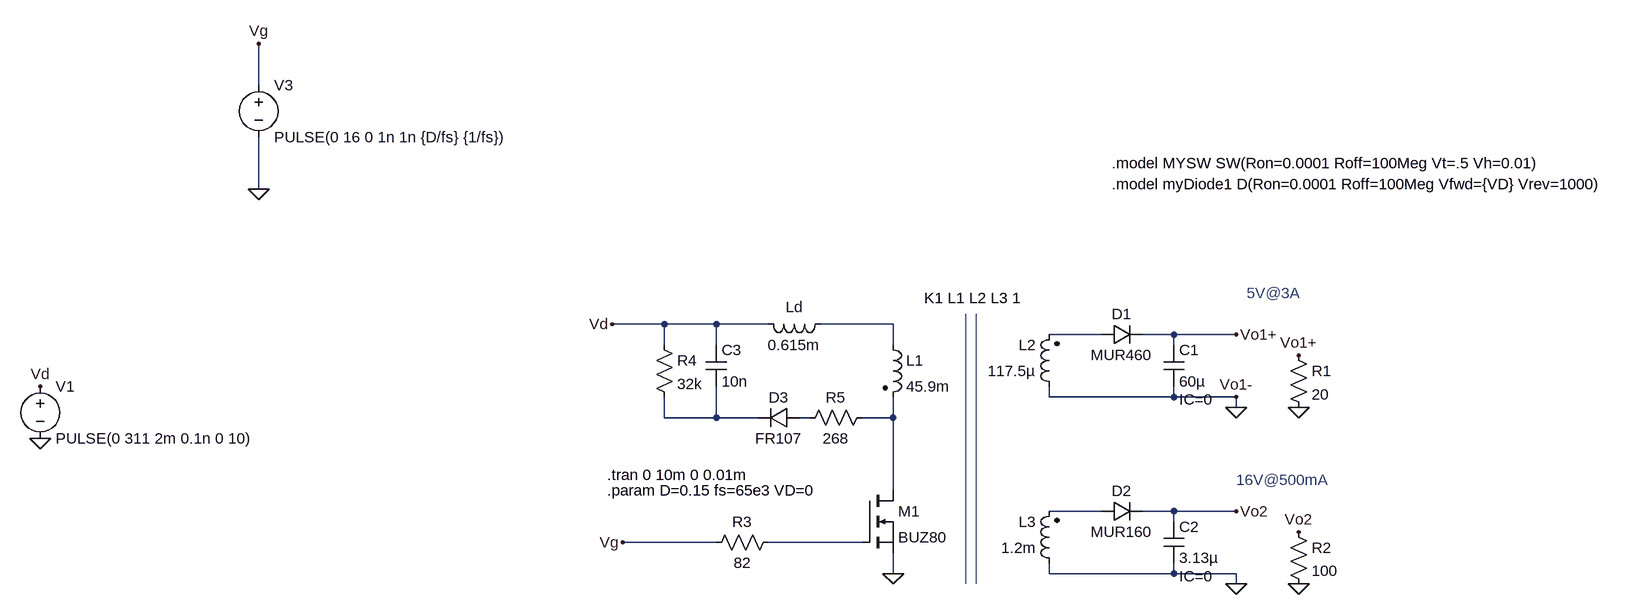
[diagram p0: schematic flyback_sin_realimentar.asc]
flyback_sin_realimentar.asc, the LTspice schematic file:
Version 4.1
SHEET 1 2496 3908
WIRE -592 -288 -592 -352
WIRE -592 -128 -592 -208
WIRE 32 80 -48 80
WIRE 112 80 32 80
WIRE 192 80 112 80
WIRE 384 80 272 80
WIRE 704 96 624 96
WIRE 816 96 768 96
WIRE 912 96 816 96
WIRE 32 112 32 80
WIRE 112 112 112 80
WIRE 384 112 384 80
WIRE 816 112 816 96
WIRE 624 192 624 176
WIRE 816 192 816 176
WIRE 816 192 624 192
WIRE 912 192 816 192
WIRE 912 208 912 192
WIRE 32 224 32 192
WIRE 112 224 112 176
WIRE 112 224 32 224
WIRE 176 224 112 224
WIRE 256 224 240 224
WIRE 384 224 384 192
WIRE 384 224 336 224
WIRE 384 336 384 224
WIRE 704 368 624 368
WIRE 816 368 768 368
WIRE 912 368 816 368
WIRE 816 384 816 368
WIRE 112 416 -32 416
WIRE 336 416 192 416
WIRE 384 464 384 432
WIRE 624 464 624 448
WIRE 816 464 816 448
WIRE 816 464 624 464
WIRE 912 464 816 464
WIRE 912 480 912 464
FLAG -928 256 0
FLAG -928 176 Vd
FLAG -48 80 Vd
FLAG 912 96 Vo1+
FLAG 912 368 Vo2
FLAG 912 480 0
FLAG 912 192 Vo1-
FLAG 912 208 0
FLAG 1008 128 Vo1+
FLAG 1008 208 0
FLAG 1008 400 Vo2
FLAG 1008 480 0
FLAG 384 464 0
FLAG -592 -128 0
FLAG -592 -352 Vg
FLAG -32 416 Vg
SYMBOL ind2 640 192 R180
WINDOW 0 36 80 Left 2
WINDOW 3 36 40 Left 2
SYMATTR InstName L2
SYMATTR Value 117.5µ
SYMATTR Type ind
SYMBOL ind2 368 96 R0
SYMATTR InstName L1
SYMATTR Value 45.9m
SYMATTR Type ind
SYMBOL voltage -928 160 R0
WINDOW 123 0 0 Left 0
WINDOW 39 0 0 Left 0
SYMATTR InstName V1
SYMATTR Value PULSE(0 311 2m 0.1n 0 10)
SYMBOL ind2 640 464 R180
WINDOW 0 36 80 Left 2
WINDOW 3 36 40 Left 2
SYMATTR InstName L3
SYMATTR Value 1.2m
SYMATTR Type ind
SYMBOL diode 704 112 R270
WINDOW 0 32 32 VTop 2
WINDOW 3 0 32 VBottom 2
SYMATTR InstName D1
SYMATTR Value MUR460
SYMBOL diode 704 384 R270
WINDOW 0 32 32 VTop 2
WINDOW 3 0 32 VBottom 2
SYMATTR InstName D2
SYMATTR Value MUR160
SYMBOL cap 800 112 R0
WINDOW 123 24 84 Left 2
SYMATTR Value2 IC=0
SYMATTR InstName C1
SYMATTR Value 60µ
SYMBOL cap 800 384 R0
WINDOW 123 24 84 Left 2
SYMATTR Value2 IC=0
SYMATTR InstName C2
SYMATTR Value 3.13µ
SYMBOL res 992 112 R0
SYMATTR InstName R1
SYMATTR Value 20
SYMBOL res 992 384 R0
SYMATTR InstName R2
SYMATTR Value 100
SYMBOL nmos 336 336 R0
SYMATTR InstName M1
SYMATTR Value BUZ80
SYMBOL res 208 400 R90
WINDOW 0 0 56 VBottom 2
WINDOW 3 32 56 VTop 2
SYMATTR InstName R3
SYMATTR Value 82
SYMBOL voltage -592 -304 R0
WINDOW 123 0 0 Left 0
WINDOW 39 0 0 Left 0
SYMATTR InstName V3
SYMATTR Value PULSE(0 16 0 1n 1n {D/fs} {1/fs})
SYMBOL ind 288 64 R90
WINDOW 0 5 56 VBottom 2
WINDOW 3 32 56 VTop 2
SYMATTR InstName Ld
SYMATTR Value 0.615m
SYMBOL cap 96 112 R0
SYMATTR InstName C3
SYMATTR Value 10n
SYMBOL res 16 96 R0
SYMATTR InstName R4
SYMATTR Value 32k
SYMBOL diode 240 208 R90
WINDOW 0 0 32 VBottom 2
WINDOW 3 32 32 VTop 2
SYMATTR InstName D3
SYMATTR Value FR107
SYMBOL res 352 208 R90
WINDOW 0 0 56 VBottom 2
WINDOW 3 32 56 VTop 2
SYMATTR InstName R5
SYMATTR Value 268
TEXT 432 40 Left 2 !K1 L1 L2 L3 1
TEXT -56 312 Left 2 !.tran 0 10m 0 0.01m
TEXT -56 336 Left 2 !.param D=0.15 fs=65e3 VD=0
TEXT 720 -168 Left 2 !.model MYSW SW(Ron=0.0001 Roff=100Meg Vt=.5 Vh=0.01)
TEXT 720 -136 Left 2 !.model myDiode1 D(Ron=0.0001 Roff=100Meg Vfwd={VD} Vrev=1000)
TEXT 928 32 Left 2 ;5V@3A
TEXT 912 320 Left 2 ;16V@500mA
LINE Normal 496 480 496 64
LINE Normal 512 480 512 64

The netlist it stands for:
* flyback_sin_realimentar.asc
L2 0 N002 117.5µ
L1 N001 N005 45.9m
V1 Vd 0 PULSE(0 311 2m 0.1n 0 10)
L3 0 N006 1.2m
D1 N002 Vo1+ MUR460
D2 N006 Vo2 MUR160
C1 Vo1+ 0 60µ IC=0
C2 Vo2 0 3.13µ IC=0
R1 Vo1+ 0 20
R2 Vo2 0 100
M1 N005 N007 0 0 BUZ80
R3 N007 Vg 82
V3 Vg 0 PULSE(0 16 0 1n 1n {D/fs} {1/fs})
Ld N001 Vd 0.615m
C3 Vd N003 10n
R4 Vd N003 32k
D3 N004 N003 FR107
R5 N005 N004 268
.model D D
.lib standard.dio
.model NMOS NMOS
.model PMOS PMOS
.lib standard.mos
K1 L1 L2 L3 1
.tran 0 10m 0 0.01m
.param D=0.15 fs=65e3 VD=0
.model MYSW SW(Ron=0.0001 Roff=100Meg Vt=.5 Vh=0.01)
.model myDiode1 D(Ron=0.0001 Roff=100Meg Vfwd={VD} Vrev=1000)
* 5V@3A
* 16V@500mA
.backanno
.end